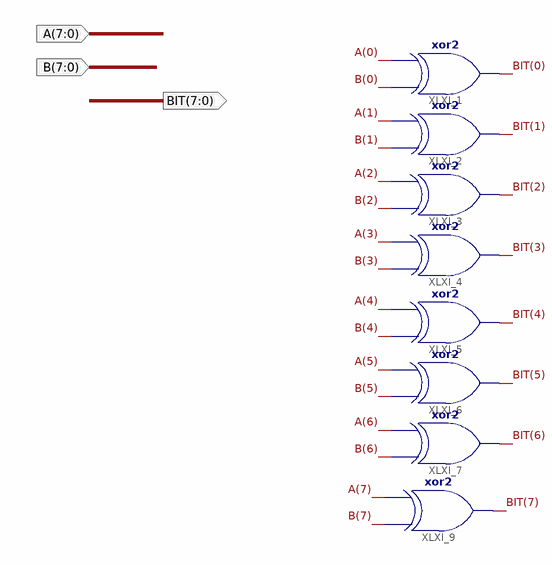
[diagram p0: schematic sheet 1]
// Xilinx ISE schematic XOR_8_BIT.sch (spartan6) as structural Verilog: 8 symbols, 3 ports
module XOR_8_BIT (
  input  [7:0] A,
  input  [7:0] B,
  output [7:0] BIT
);

  xor XLXI_1 (BIT[0], B[0], A[0]);
  xor XLXI_2 (BIT[1], B[1], A[1]);
  xor XLXI_3 (BIT[2], B[2], A[2]);
  xor XLXI_4 (BIT[3], B[3], A[3]);
  xor XLXI_5 (BIT[4], B[4], A[4]);
  xor XLXI_6 (BIT[5], B[5], A[5]);
  xor XLXI_7 (BIT[6], B[6], A[6]);
  xor XLXI_9 (BIT[7], B[7], A[7]);
endmodule
